# Altium schematic sheet ZOWI_Main_Board_Peripherals.SchDoc: Peripherals
size A4; Author: Raúl de Pablos; CompanyName: bq - Mundo Reader; Organization: bq - Mundo Reader; DocumentNumber: 3; Revision: 1.0; SheetNumber: 3; SheetTotal: 9
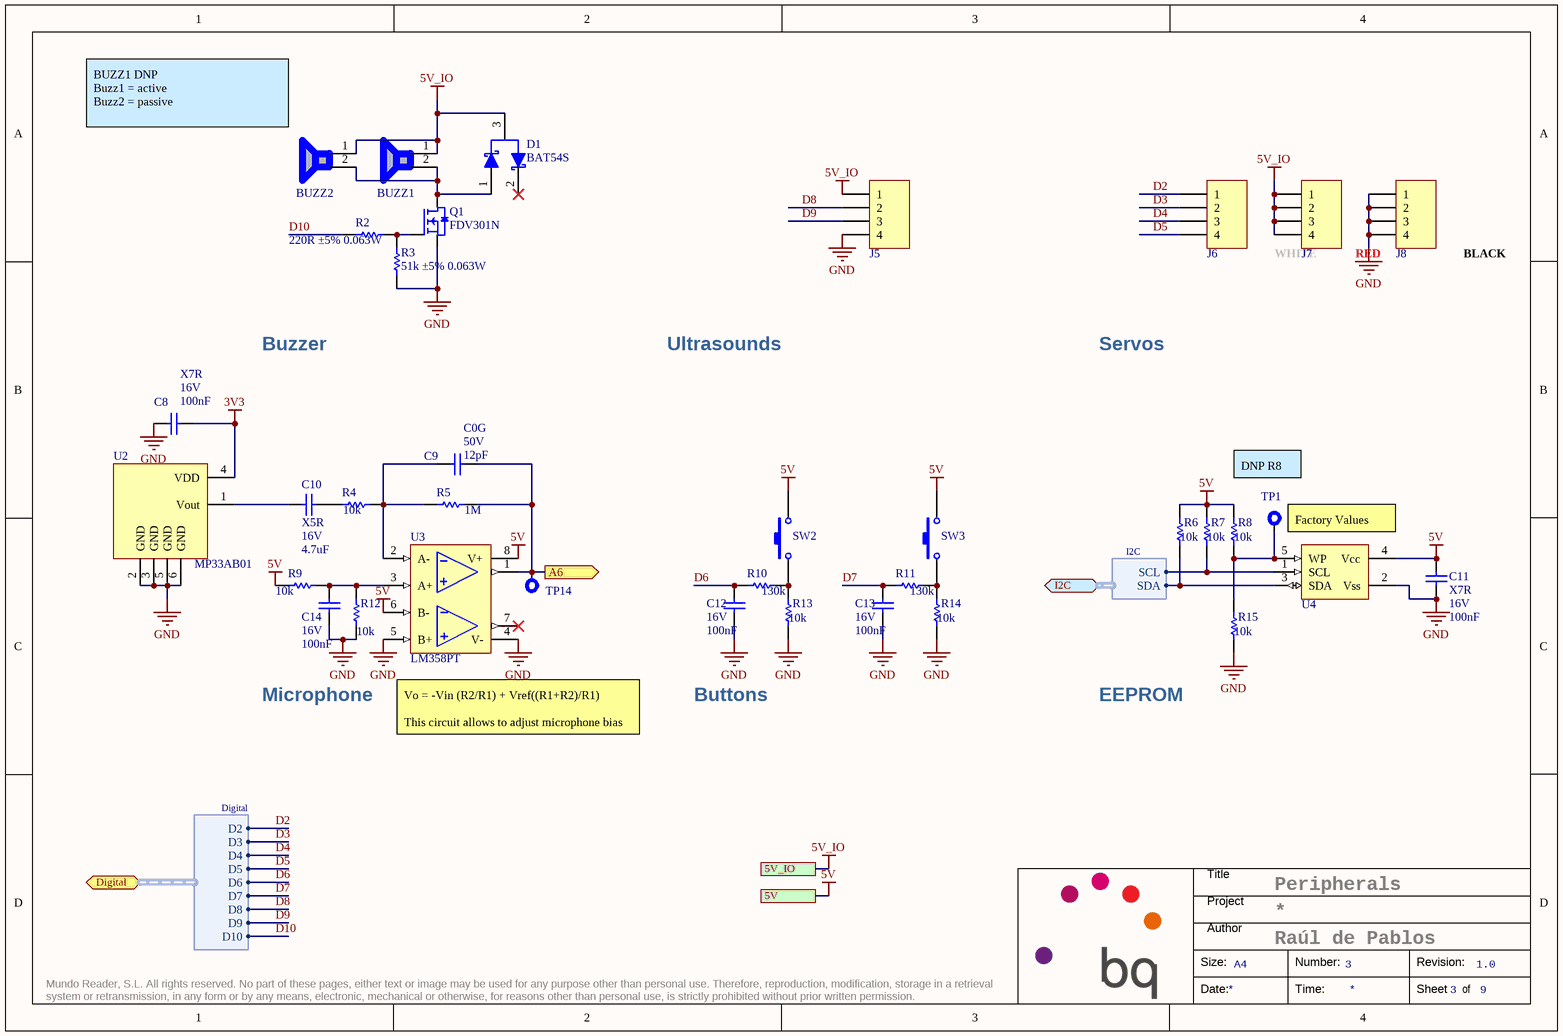
[diagram p0: ZOWI_Main_Board_Peripherals.SchDoc]

## Parts
BUZZ1  BUZZER  [KXG1205C]  (value not drawn)  (no BOM)
BUZZ2  BUZZER  [BUZZER_12]  (value not drawn)
C8  Dielectric: X7R  Voltage: 16V  Capacitance: 100nF  [C0402]  (hidden comment: Capacitor)
C9  Dielectric: C0G  Voltage: 50V  Capacitance: 12pF  [C0402]  (hidden comment: Capacitor)
C10  Dielectric: X5R  Voltage: 16V  Capacitance: 4.7uF  [C0603]  (hidden comment: Capacitor)
C11  Dielectric: X7R  Voltage: 16V  Capacitance: 100nF  [C0402]  (hidden comment: Capacitor)
C12  Voltage: 16V  Capacitance: 100nF  [C0402]  (hidden comment: Capacitor)
C13  Voltage: 16V  Capacitance: 100nF  [C0402]  (hidden comment: Capacitor)
C14  Voltage: 16V  Capacitance: 100nF  [C0402]  (hidden comment: Capacitor)
D1  BAT54S  [SOT23-3]
J5  1x4 pin Header 2.54mm  [1x4 Pin Header 2.54]  (value not drawn)
J6  1x4 pin Header 2.54mm  [1x4 Pin Header 2.54]  (value not drawn)
J7  1x4 pin Header 2.54mm  [1x4 Pin Header 2.54]  (value not drawn)
J8  1x4 pin Header 2.54mm  [1x4 Pin Header 2.54]  (value not drawn)
Q1  FDV301N  [SOT23-3]
R2  value 220R ±5% 0.063W  [R0402]  (hidden comment: Resistor)
R3  value 51k ±5% 0.063W  [R0402]  (hidden comment: Resistor)
R4  Resistance: 10k  [R0402]  (hidden comment: Resistor)
R5  Resistance: 1M  [R0402]  (hidden comment: Resistor)
R6  Resistance: 10k  [R0402]  (hidden comment: Resistor)
R7  Resistance: 10k  [R0402]  (hidden comment: Resistor)
R8  Resistance: 10k  [R0402]  (hidden comment: Resistor)  (no BOM)
R9  Resistance: 10k  [R0402]  (hidden comment: Resistor)
R10  Resistance: 130k  [R0402]  (hidden comment: Resistor)
R11  Resistance: 130k  [R0402]  (hidden comment: Resistor)
R12  Resistance: 10k  [R0402]  (hidden comment: Resistor)
R13  Resistance: 10k  [R0402]  (hidden comment: Resistor)
R14  Resistance: 10k  [R0402]  (hidden comment: Resistor)
R15  Resistance: 10k  [R0402]  (hidden comment: Resistor)
SW2  Switch  [MJTP1105T]  (value not drawn)
SW3  Switch  [MJTP1105T]  (value not drawn)
TP1  Testpoint  [TP_SMD_1mm]  (value not drawn)  (no BOM)
TP14  Testpoint  [TP_SMD_1mm]  (value not drawn)  (no BOM)
U2  MP33AB01  [RHLGA]
U3  LM358PT  [TSSOP8]
U4  24AA01  [SOT23-5]  (value not drawn)

## Ports
5V, 5V_IO, A6 (out), Digital (harness Digital), I2C (harness I2C)

## Harnesses
Digital: D2, D3, D4, D5, D6, D7, D8, D9, D10
I2C: SDA, SCL

## Nets
3V3: C8.1 U2.4(VDD)
5V: C11.2 R6.2 R7.2 R8.2 R9.1 SW2.2 SW3.2 U3.6(B-) U3.8(V+) U4.4(Vcc) ; port 5V
5V_IO: BUZZ1.1 BUZZ2.1 D1.3(K1) J5.1 J7.1 J7.2 J7.3 J7.4 ; port 5V_IO
GND: C8.2 C11.1 C12.1 C13.1 C14.1 J5.4 J8.1 J8.2 J8.3 J8.4 Q1.2(S) R3.1 R12.1 R13.1 R14.1 R15.1 U2.2(GND) U2.3(GND) U2.5(GND) U2.6(GND) U3.4(V-) U3.5(B+) U4.2(Vss)
A6: C9.2 R5.2 TP14.1 U3.1(Out) ; port A6
D2: J6.1 ; port Digital.D2
D3: J6.2 ; port Digital.D3
D4: J6.3 ; port Digital.D4
D5: J6.4 ; port Digital.D5
D6: C12.2 R10.2 ; port Digital.D6
D7: C13.2 R11.2 ; port Digital.D7
D8: J5.2 ; port Digital.D8
D9: J5.3 ; port Digital.D9
D10: R2.1 ; port Digital.D10
NetBUZZ1_2: BUZZ1.2 BUZZ2.2 D1.1(A) Q1.3(D)
NetC9_1: C9.1 R4.2 R5.1 U3.2(A-)
NetC10_1: C10.1 U2.1(Vout)
NetC10_2: C10.2 R4.1
NetC14_2: C14.2 R9.2 R12.2 U3.3(A+)
NetQ1_1: Q1.1(G) R2.2 R3.2
NetR6_1: R6.1 U4.3(SDA) ; port I2C.SDA
NetR7_1: R7.1 U4.1(SCL) ; port I2C.SCL
NetR8_1: R8.1 R15.2 TP1.1 U4.5(WP)
NetR10_1: R10.1 R13.2 SW2.1
NetR11_1: R11.1 R14.2 SW3.1

Not connected (* = marked no-connect by the designer): D1 2(K2)*; U3 7(Out2)*

## Notes on the sheet
- (near BUZZ2) BUZZ1 DNP
  Buzz1 = active
  Buzz2 = passive
- WHITE
- RED
- (near J8) BLACK
- Buzzer
- Ultrasounds
- Servos
- DNP R8
- (near TP1) Factory Values
- Microphone
- Buttons
- EEPROM
- (near U3) Vo = -Vin (R2/R1) + Vref((R1+R2)/R1)
  This circuit allows to adjust microphone bias
- Title
- Project
- Size:
- Author
- A4
- Number:
- Revision:
- Mundo Reader, S.L. All rights reserved. No part of these pages, either text or image may be used for any purpose other than personal use. Therefore, reproduction, modification, storage in a retrieval system or retransmission, in any form or by any means, electronic, mechanical or otherwise, for reasons other than personal use, is strictly prohibited without prior written permission.
- Date:
- Time:
- Sheet
- of

## Library data of the parts
BUZZ1 = KXG1205C: Manufacturer: Kingstate Elect.; Temp_ Max: 70; Temp_ Min: -30; OrderingCode: KXG1205C; Part Number: KXG1205C
BUZZ2 = BUZZER_12: Manufacturer: Kingstate Elect.; OrderingCode: KXG1205; Temp_ Max: 75; Temp_ Min: -30; Part Number: KXG1205
C8 C11 = C0402_100nF_16V_±10%: Capacitor SMD; Manufacturer: Kemet; Value: 100nF ±10% 16V; Tolerance: ±10%; OrderingCode: C0402C104K4RAC; Temp_ Max: 125; Temp_ Min: -55; Part Number: C0402_100nF_16V_±10%
C9 = C0402_12pF_50V_±5%: Capacitor SMD; Manufacturer: Murata; Value: 12pF ±5% 50V; Tolerance: ±5%; OrderingCode: GJM1555C1H120JB01D; Temp_ Max: 125; Temp_ Min: -55; Part Number: C0402_12pF_50V_±5%
C10 = C0603_4.7uF_16V_±10%: Capacitor SMD; Manufacturer: TDK; Value: 4.7uF ±10% 16V; Tolerance: ±10%; OrderingCode: C1608X5R1C475K080AC; Temp_ Max: 85; Temp_ Min: -55; Part Number: C0603_4.7uF_16V_±10%
C12-C14 = C0402_100nF_16V_±10%: Capacitor SMD; Manufacturer: Kemet; Value: 100nF ±10% 16V; Dielectric: X7R; Tolerance: ±10%; OrderingCode: C0402C104K4RAC; Temp_ Max: 125; Temp_ Min: -55; Part Number: C0402_100nF_16V_±10%
D1 = BAT54S: Dual Schottky Diode; Manufacturer: NXP; Ifor: 200mA; Vrrm: 30V; Ifsm: 600mA; Vf: 0,8V; Temp_ Max: 150; Temp_ Min: -55; Value: 200mA 30V; Part Number: BAT54S; OrderingCode: BAT54S; Manufacturer 2: Vishay; OrderingCode 2: BAT54S
J5 J8 = CON_PH_THT2.54_4: Connector, 1x4 pin Header 2.54mm; Manufacturer: Samtec; OrderingCode: TSW-104-07-T-S; Temp_ Max: 105; Temp_ Min: -55; OrderingCode 2: 613 004 111 21; Value: 4; Pitch: 2.54mm; Part Number: CON_PH_THT2.54_4; Manufacturer 2: Würth Elektronik
J6 = CON_PH_THT2.54_4 Natural: Connector, 1x4 pin Header 2.54mm; Manufacturer: Samtec; OrderingCode: TSW-104-07-T-S-NATURAL; Temp_ Max: 105; Temp_ Min: -55; Pitch: 2.54mm; Part Number: CON_PH_THT2.54_4 Natural
J7 = CON_PH_THT2.54_4 Red: Connector, 1x4 pin Header 2.54mm; Manufacturer: Samtec; OrderingCode: TSW-104-07-T-S-RED; Temp_ Max: 105; Temp_ Min: -55; Pitch: 2.54mm; Part Number: CON_PH_THT2.54_4 Red
Q1 = FDV301N: NFET; Manufacturer: Fairchild Semiconductor; Vds: 25V; Vgss: 8V; Id: 0,22A; Temp_ Max: 150; Temp_ Min: -55; Part Number: FDV301N; OrderingCode: FDV301N
R2 = R0402_220R_0.063W_±5%: Resistor, SMD; Manufacturer: Vishay; Tolerance: ±5%; OrderingCode: CRCW0402220RJN; Power: 0.063W; Resistance: 220R; Temp_ Max: 155; Temp_ Min: -55; PackageDescription: SMD; Part Number: R0402_220R_0.063W_±5%
R3 = R0402_51k_0.063W_±5%: Resistor, SMD; Manufacturer: Vishay; Tolerance: ±5%; OrderingCode: CRCW040251K0JN; Power: 0.063W; Resistance: 51k; Temp_ Max: 155; Temp_ Min: -55; PackageDescription: SMD; Part Number: R0402_51k_0.063W_±5%
R4 R6-R9 R12-R15 = R0402_10k_0.063W_±5%: Resistor, SMD; Manufacturer: Vishay; Tolerance: ±5%; OrderingCode: CRCW040210K0JN; Power: 0.063W; Value: 10k ±5% 0.063W; Temp_ Max: 155; Temp_ Min: -55; PackageDescription: SMD; Part Number: R0402_10k_0.063W_±5%
R5 = R0402_1M_0.063W_±5%: Resistor, SMD; Manufacturer: Vishay; Tolerance: ±5%; OrderingCode: CRCW04021M00JNED; Power: 0.063W; Value: 1M ±5% 0.063W; Temp_ Max: 155; Temp_ Min: -55; PackageDescription: SMD; Part Number: R0402_1M_0.063W_±5%
R10 R11 = R0402_130k_0.063W_±1%: Resistor, SMD; Manufacturer: Vishay; Tolerance: ±1%; OrderingCode: CRCW0402130KFK; Power: 0.063W; Value: 130k ±1% 0.063W; Temp_ Max: 155; Temp_ Min: -55; PackageDescription: SMD; Part Number: R0402_130k_0.063W_±1%
SW2 SW3 = MJTP1105T: Micro miniature pushbutton surface Switch; Manufacturer: APEM; Temp_ Max: 70; Temp_ Min: -20; Part Number: MJTP1105T; OrderingCode: MJTP1105T
TP1 TP14 = TP_SMD_1mm: Manufacturer: Oxley; OrderingCode: SMOX/060/B1; SAP: 303552; Part Number: TP_SMD_1mm
U2 = MP33AB01: Microphone MEMS audio surface-mount; Manufacturer: ST Microelectronics; OrderingCode: MP33AB01HTR; Temp_ Max: 100; Temp_ Min: -30; Part Number: MP33AB01
U3 = LM358: Operational Amplifier Dual; Manufacturer: ST; Vdc: 1,5÷15 Vdc; Temp_ Max: 80; Temp_ Min: 0; OrderingCode 2: LM358PWR; Part Number: LM358; OrderingCode: LM358PT; Manufacturer 2: Texas Instruments
U4 = 24AA01T-I/OT: EEPROM Memory I2C 1KBIT 400KHZ SOT23-5; Manufacturer: Microchip; Temp_ Max: 85; Temp_ Min: -40; Part Number: 24AA01T-I/OT; OrderingCode: 24AA01T-I/OT